# EAGLE design DACV5 (EAGLE 6.1)
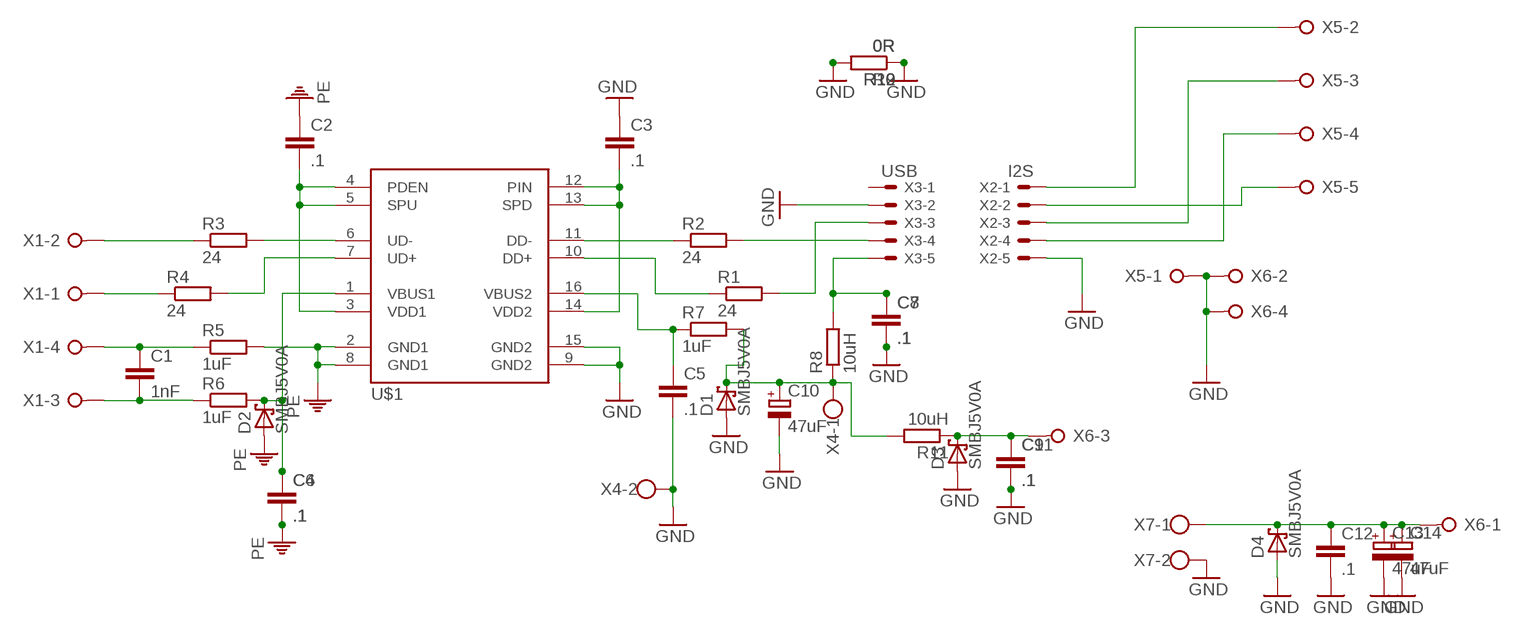
[diagram p0: schematic, sheet 1]

## Parts
C1  1nF  C-EUC1210  [C1210]
C2  .1  C-EUC1210  [C1210]
C3  .1  C-EUC1210  [C1210]
C4  .1  C-EUC1210  [C1210]
C5  .1  C-EUC1210  [C1210]
C6  .1  C-EUC1210  [C1210]
C7  .1  C-EUC1210  [C1210]
C8  .1  C-EUC1210  [C1210]
C9  .1  C-EUC1210  [C1210]
C10  47uF  CPOL-EUE5-13  [E5-13]
C11  .1  C-EUC1210  [C1210]
C12  .1  C-EUC1210  [C1210]
C13  47uF  CPOL-EUE5-13  [E5-13]
C14  47uF  CPOL-EUE5-13  [E5-13]
D1  SMBJ5V0A  MBRS130LT3  [SMB]
D2  SMBJ5V0A  MBRS130LT3  [SMB]
D3  SMBJ5V0A  MBRS130LT3  [SMB]
D4  SMBJ5V0A  MBRS130LT3  [SMB]
R1  24  R-EU_R1210  [R1210]
R2  24  R-EU_R1210  [R1210]
R3  24  R-EU_R1210  [R1210]
R4  24  R-EU_R1210  [R1210]
R5  1uF  R-EU_R1210  [R1210]
R6  1uF  R-EU_R1210  [R1210]
R7  1uF  R-EU_R1210  [R1210]
R8  10uH  R-EU_0309/12  [0309/12]
R9  0R  R-EU_0309/12  [0309/12]
R10  0R  R-EU_0309/12  [0309/12]
R11  10uH  R-EU_0309/12  [0309/12]
R12  0R  R-EU_0309/12  [0309/12]
U$1  ADUM4160  [SO16W]
X1  W237-04P  [W237-4P]
X2  I2S  22-23-2051  [22-23-2051]
X3  USB  22-23-2051  [22-23-2051]
X4  W237-102  [W237-102]
X5  W237-05P  [W237-5P]
X6  W237-04P  [W237-4P]
X7  W237-102  [W237-102]

## Nets
GND: C3.1 C5.2 C7.2 C8.2 C9.2 C10.- C11.2 C12.2 C13.- C14.- D1.A D3.A D4.A R9.1 R9.2 R10.1 R10.2 R12.1 R12.2 U$1.9(GND2) U$1.15(GND2) X2.5 X3.2 X4.2 X5.1 X6.2 X6.4 X7.2
N$1: X2.1 X5.2
N$2: R1.2 X3.3
N$3: R1.1 U$1.10(DD+)
N$4: R4.1 X1.1
N$5: R3.1 X1.2
N$6: R2.1 U$1.11(DD-)
N$7: R2.2 X3.4
N$8: R3.2 U$1.6(UD-)
N$9: R4.2 U$1.7(UD+)
N$10: C1.1 R5.1 X1.4
N$11: C1.2 R6.1 X1.3
N$12: C10.+ D1.C R7.2 R8.1 R11.2 X4.1
N$13: C7.1 C8.1 R8.2 X3.5
N$14: X2.3 X5.3
N$15: X2.2 X5.5
N$16: X2.4 X5.4
N$17: C9.1 C11.1 D3.C R11.1 X6.3
N$18: C12.1 C13.+ C14.+ D4.C X6.1 X7.1
PE: C2.1 C4.2 C6.2 D2.A R5.2 U$1.2(GND1) U$1.8(GND1)
VBUS1: C4.1 C6.1 D2.C R6.2 U$1.1(VBUS1)
VBUS2: C5.1 R7.1 U$1.16(VBUS2)
VDD1: C2.2 U$1.3(VDD1) U$1.4(PDEN) U$1.5(SPU)
VDD2: C3.2 U$1.12(PIN) U$1.13(SPD) U$1.14(VDD2)
Unconnected: X3.1

## Library data of the parts
C1-C9 C11 C12 = resistor:C-EU: CAPACITOR, European symbol
C10 C13 C14 = resistor:CPOL-EU: POLARIZED CAPACITOR, European symbol
D1-D4 = diode:MBRS130LT3: Schottky Power Rectifier Source: http://www.onsemi.com/pub/Collateral/MBRS130LT3-D.PDF
R1-R12 = resistor:R-EU_: RESISTOR, European symbol
U$1 = adum4160:ADUM4160: Analog Devices ADuM4160 Low/Full Speed USB Isolator. Production-tested footprint. Created by Circuits At Home http://www.circuitsathome.com Free to use for non-commercial purposes
X1 X6 = con-wago-508:W237-04P: WAGO SREW CLAMP; OC_FARNELL: unknown; OC_NEWARK: unknown
X2 X3 = con-molex:22-23-2051: .100" (2.54mm) Center Header - 5 Pin; MF: MOLEX; MPN: 22-23-2051; OC_FARNELL: 1462952; OC_NEWARK: 38C9178
X4 X7 = con-wago-500:W237-102: WAGO SCREW CLAMP; MPN: 237-102; OC_FARNELL: unknown; OC_NEWARK: 70K9898
X5 = con-wago-508:W237-05P: WAGO SREW CLAMP; OC_FARNELL: unknown; OC_NEWARK: unknown

## Board
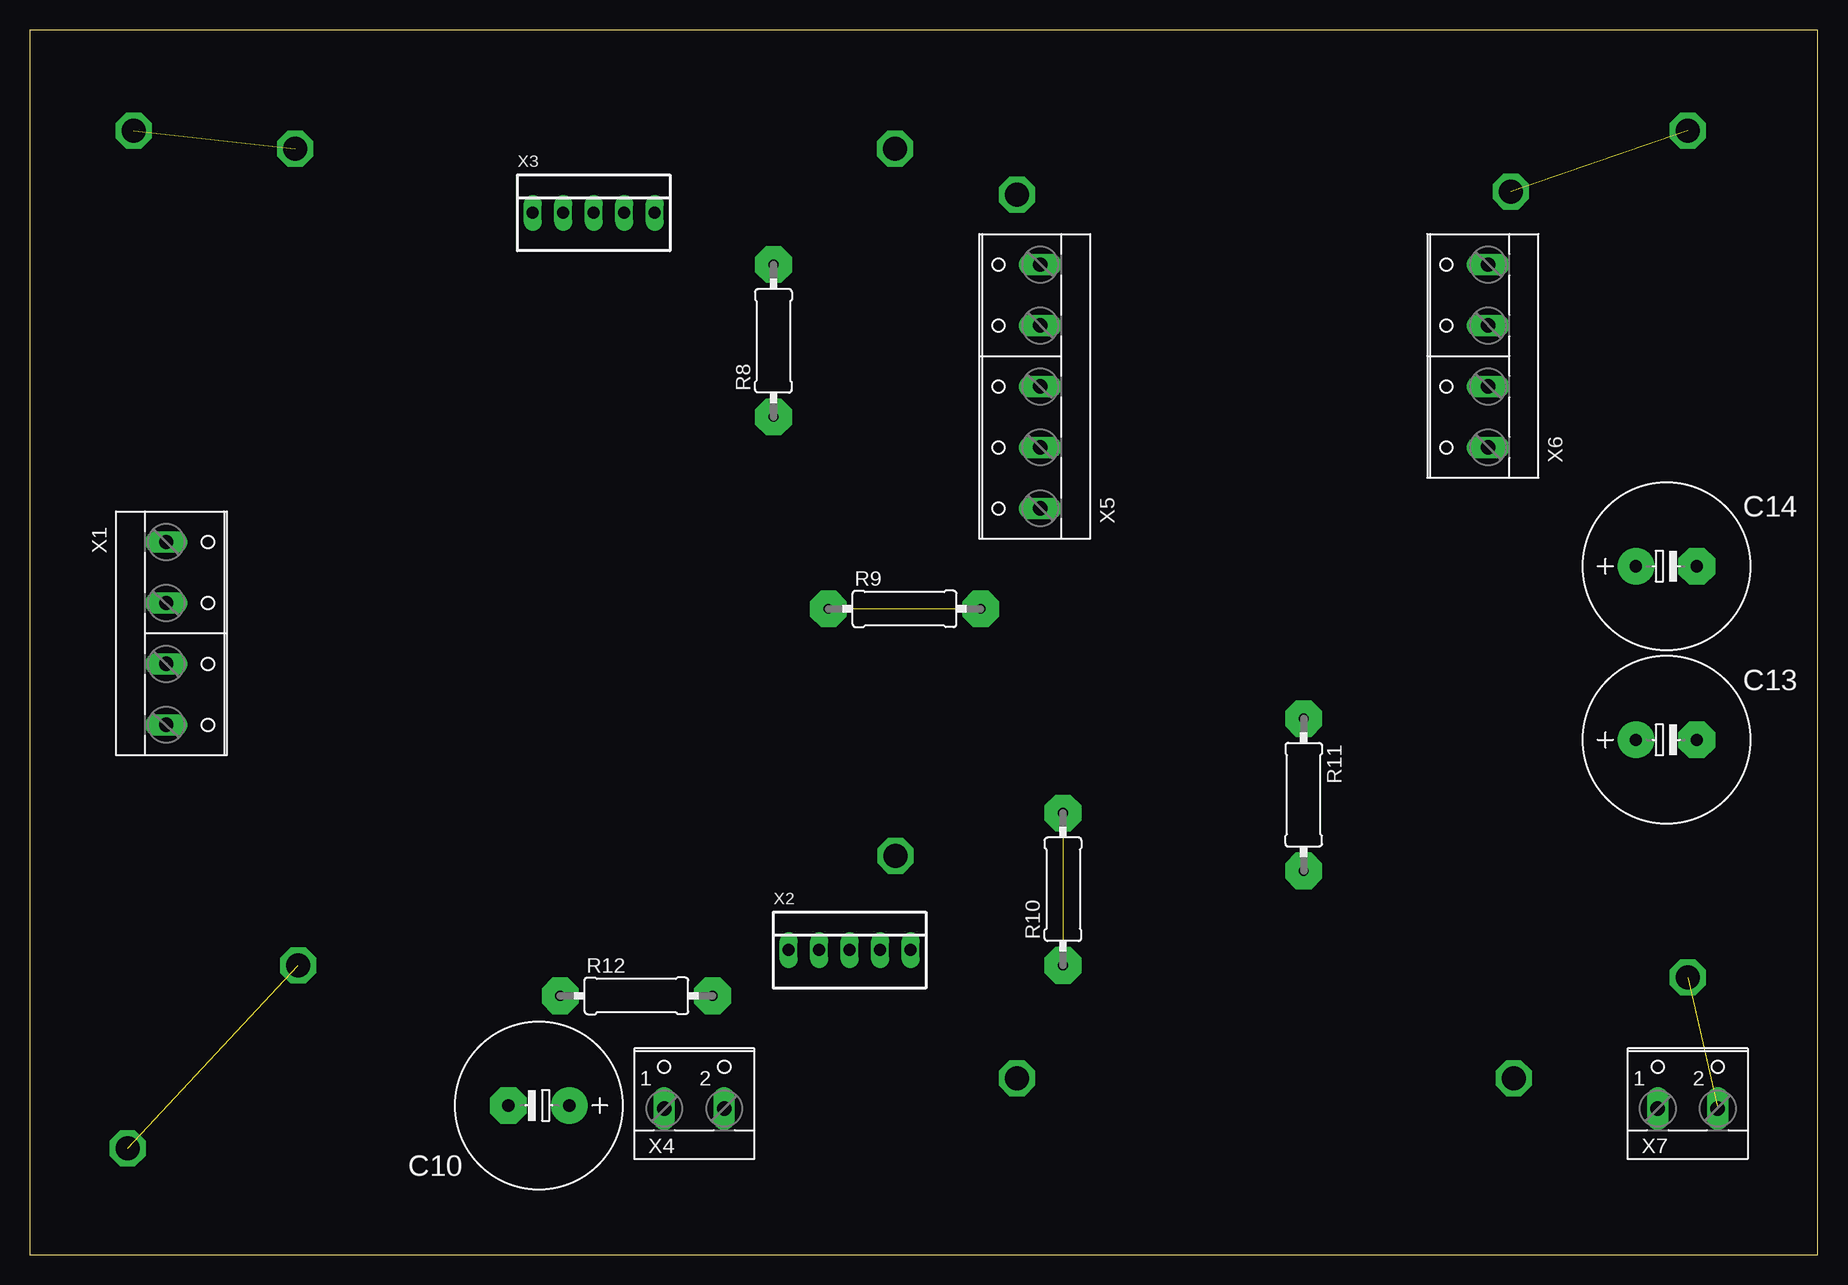
[diagram p1: board, top side]
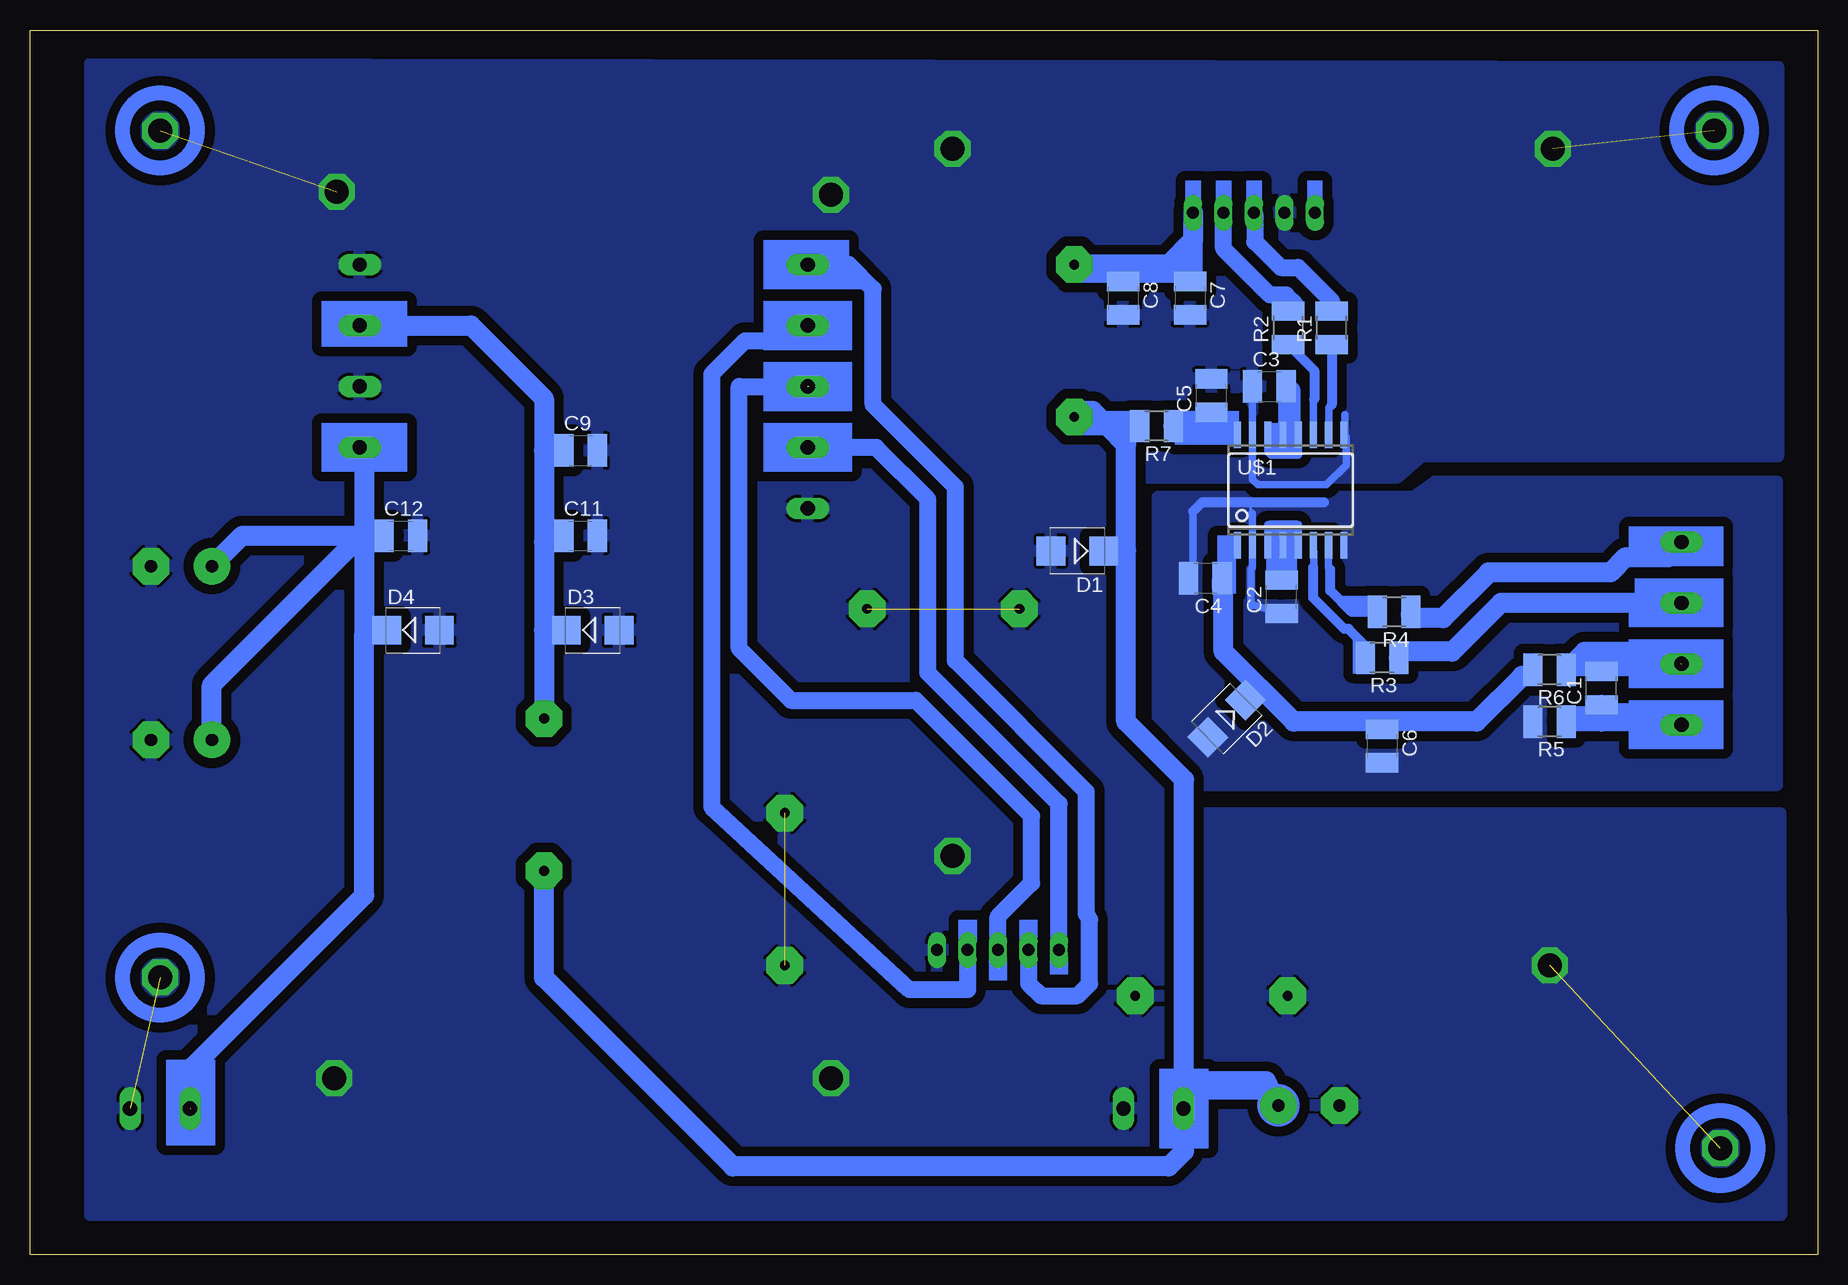
[diagram p2: board, bottom side, seen from below]

Size 149.02 x 102.09 mm. Coordinates in mm from the lower left corner, seen from the top.
Outline: 0,102.09 0,0 149.02,0 149.02,102.09 0,102.09
Copper layers (1*16): Top 0.035mm / dielectric 1.5mm / Bottom 0.035mm
Design rules: minimum track width 10mil, minimum drill 24mil, track to track 8mil, track to pad 8mil, pad to pad 8mil, via to via 8mil, smd to smd 8mil, copper to edge 40mil, drill to drill 8mil, minimum pad ring 10mil, minimum via ring 8mil, stop-mask expansion 4mil, vias tented up to drill 0mil, thermal gap 10mil

### Footprints (pad centres in the part's own frame; a part is rotated, then mirrored left to right if it is on the bottom)
C1210 = smd 1.6 x 2.7: 1 -1.4,0; 2 1.4,0
E5-13 = drill 1.016 pad 3.048: + -2.54,0 | drill 1.016 pad 3.048 octagon: - 2.54,0
SMB = smd 2.4 x 2.4: A 2.2,0; C -2.2,0
R1210 = smd 1.6 x 2.7: 1 -1.4,0; 2 1.4,0
0309/12 = drill 0.813 pad 3.048 octagon: 1 -6.35,0; 2 6.35,0
SO16W = smd 0.6 x 2.2: 1 -4.445,-4.6; 2 -3.175,-4.6; 3 -1.905,-4.6; 4 -0.635,-4.6; 5 0.635,-4.6; 6 1.905,-4.6; 7 3.175,-4.6; 8 4.445,-4.6; 9 4.445,4.6; 10 3.175,4.6; 11 1.905,4.6; 12 0.635,4.6; 13 -0.635,4.6; 14 -1.905,4.6; 15 -3.175,4.6; 16 -4.445,4.6
W237-4P = drill 1.194 long: 1 -7.62,-0.635; 2 -2.54,-0.635; 3 2.54,-0.635; 4 7.62,-0.635
22-23-2051 = drill 1 long: 1 -5.08,0; 2 -2.54,0; 3 0,0; 4 2.54,0; 5 5.08,0
W237-102 = drill 1.194 long: 1 -2.5,-1.27; 2 2.5,-1.27
W237-5P = drill 1.194 long: 1 -10.16,-0.635; 2 -5.08,-0.635; 3 0,-0.635; 4 5.08,-0.635; 5 10.16,-0.635

### Placement (x,y rotation side)
C1  18.03,47.22 90 bottom
C2  44.7,54.84 90 bottom
C3  45.72,72.37 0 bottom
C4  51.05,56.37 180 bottom
C5  50.55,71.61 90 bottom
C6  36.32,42.4 270 bottom
C7  52.32,79.74 270 bottom
C8  57.91,79.74 270 bottom
C9  103.12,67.04 0 bottom
C10  42.42,12.43 180 top
C11  103.12,59.92 0 bottom
C12  118.11,59.92 0 bottom
C13  136.4,42.91 0 top
C14  136.4,57.38 0 top
D1  61.72,58.65 180 bottom
D2  49.28,44.68 224.9 bottom
D3  102.11,52.05 0 bottom
D4  117.09,52.05 0 bottom
R1  40.51,77.26 90 bottom
R2  44.13,77.26 90 bottom
R3  36.32,49.76 180 bottom
R4  35.31,53.57 180 bottom
R5  22.35,44.43 180 bottom
R6  22.35,48.75 180 bottom
R7  55.12,69.07 180 bottom
R8  61.98,76.18 90 top
R9  72.9,53.83 0 top
R10  86.11,30.46 90 top
R11  106.17,38.33 270 top
R12  50.55,21.57 0 top
U$1  43.94,63.73 0 bottom
X1  11.99,51.78 270 top
X2  68.33,25.38 0 top
X3  46.99,86.85 0 top
X4  55.37,13.44 0 top
X5  83.57,72.37 90 top
X6  120.9,74.91 90 top
X7  138.18,13.44 0 top

### Tracks (layer width: path | path; a pad name or v marks a point on that pad's centre or on a via)
GND  (via drill 2 pad 1.68)  (6 unrouted)
  Bottom 0.61: 39.43,70.02 39.43,68.4 U$1.9 39.31,68.14 39.31,65.83 40.96,64.18 46.67,64.18 47.12,64.62 U$1.15 47.12,70.46 47.12,70.47 C3.1
  other vias: 22.1,92.18 72.11,92.18 22.35,24.11 72.14,33.25 82.27,88.37 123.44,88.63 82.27,14.71 123.67,14.71 8.64,93.71 8.13,8.87 138.18,23.09 138.18,93.71
  pour Bottom (isolate 0.813): 3.3,99.04 3.3,66.53 33.02,66.53 35.05,64.75 57.15,64.75 52.65,36.81 3.12,36.81 3.05,3.28 144.02,3.28 144.02,99.29
N$1
  Bottom 1.422: X2.1 63.25,37.57 74.17,48.49 74.17,62.97 78.49,67.29 X5.2
N$2
  Bottom 1.422: X3.3 46.93,86.78 46.93,84.44 44.77,82.28 43.31,82.28 40.51,79.48 R1.2
N$3
  Bottom 0.61: 40.51,70.85 40.77,70.59 U$1.10
  Bottom 0.813: R1.1 40.51,70.85
N$4
  Bottom 1.422: X1.1 12.61,58.15
  Bottom 1.676: R4.1 33.91,53.19 33.78,53.07 31.24,53.07 27.43,56.88 17.27,56.88 16,58.15 12.61,58.15 12.45,58.15
N$5
  Bottom 1.676: X1.2 11.37,54.34 26.42,54.34 30.48,50.27 34.54,50.27 34.54,50.14 R3.1
N$6
  Bottom 0.61: 41.97,71.29 42.04,71.23 U$1.11
  Bottom 0.813: R2.1 41.97,73.7 41.97,71.29
N$7
  Bottom 1.422: R2.2 43.56,79.23 44.32,79.99 45.66,79.99 49.53,83.86 X3.4
N$8
  Bottom 0.61: 42.06,57.28 42.01,57.33 42.01,58.55 42.04,58.58 U$1.6
  Bottom 0.813: R3.2 37.64,49.84 37.64,49.97 37.69,50.02 37.69,50.73 39.12,52.15 39.47,52.15 42.06,54.74 42.06,57.28
N$9
  Bottom 0.61: 40.64,57.13 40.79,57.28 40.79,59.16 | 40.79,59.21 40.79,59.16 | U$1.7 40.79,59.16
  Bottom 0.813: R4.2 38.86,53.57 40.64,55.35 40.64,57.13
N$10
  Bottom 1.676: X1.4 11.62,44.43 18.03,44.43 | 18.03,44.43 R5.1 | C1.1 18.03,44.43
N$11  (1 unrouted)
  Bottom 1.676: R6.1 19.43,50.27 18.03,50.27 | 18.03,50.27 12.95,50.27 11.94,49.26 11.43,49.26 | C1.2 18.03,50.27
N$12
  Bottom 1.422: D1.C 57.66,58.65 | 52.83,14.46 52.83,11.41
  Bottom 1.676: X4.1 52.83,12.21 | 52.83,14.46 52.83,39.6 57.66,44.43 57.66,58.65 57.66,67.54 59.05,68.94 | 59.05,68.94 60.45,70.34 62.23,70.34 61.98,70.08 R8.1 | R7.2 56.64,68.94 59.05,68.94 | 52.83,12.21 52.58,12.47 52.58,12.68 | C10.+ 45.97,14.46 52.83,14.46 | 52.83,14.46 52.83,12.21 | 52.83,11.41 52.83,8.62 54.1,7.35 90.42,7.35 106.17,23.09 R11.2
N$13
  Bottom 1.676: X3.5 52.07,84.56 54.1,82.53 54.23,82.53 | 54.23,82.53 57.91,82.53 | 57.91,82.53 R8.2 | C7.1 54.23,82.53 | C8.1 57.91,82.53
N$14  (1 unrouted)
  Bottom 1.422: X2.3 68.33,28.17 65.53,30.97 65.53,36.56 75.18,46.21 85.6,46.21 89.92,50.53 89.92,72.37 84.07,72.37
N$15
  Bottom 1.422: X2.2 65.79,22.59 64.77,21.57 61.72,21.57 60.71,22.59 60.71,27.92 60.96,28.43 60.96,38.59 71.88,49.51 71.88,63.99 78.74,70.85 78.74,80.5 80.77,82.53 84.07,82.53 84.33,82.78 84.33,82.53 X5.5
N$16
  Bottom 1.422: X2.4 70.87,22.08 75.69,22.08 92.2,37.32 92.2,73.39 89.41,76.18 84.84,76.18 84.84,76.94 84.58,77.2 84.58,77.07 84.96,76.69
  Bottom 1.676: X5.4 84.96,76.69
N$17
  Bottom 1.676: X6.3 112.27,77.45 106.17,71.35 106.17,67.04 | 106.17,67.04 106.17,59.42 | 106.17,52.05 R11.1 | C11.1 105.41,59.92 105.41,59.67 105.92,59.67 106.17,59.42 | 106.17,59.42 106.17,52.05 | 106.17,52.05 D3.C | C9.1 106.17,67.04
N$18  (1 unrouted)
  Bottom 1.676: X6.1 121.16,66.91 | 121.16,66.91 121.16,60.18 | 121.16,60.18 121.16,59.92 | 121.16,59.92 121.16,51.8 | D4.C 119.55,51.8 121.16,51.8 | C12.1 119.76,60.18 121.16,60.18 | 121.16,67.04 121.16,66.91 | 135.64,12.17 135.38,12.17 | X7.1 135.38,12.47 135.38,15.73 121.16,29.95 121.16,51.8 | C14.+ 131.32,59.92 121.41,59.92 | C13.+ 133.86,47.48 121.41,59.92 | 121.41,59.92 121.16,59.92
PE
  Bottom 0.254: 47.12,61.77 47.24,61.89 47.24,62.72
  Bottom 0.61: 47.18,61.83 47.12,61.77 U$1.2 47.12,57.26 47.24,57.13 47.24,54.08 47.12,54.21 C2.1 | C4.2 52.07,56.5 52.07,61.96
  Bottom 0.813: 52.07,61.96 51.31,62.72 47.24,62.72 41.15,62.72
  pour Bottom (isolate 0.813, no thermals): 3.3,64.5 32,64.5 33.78,63.23 55.12,63.23 55.12,44.94 55.09,39.07 3.3,39.07
VBUS1
  Bottom 0.254: C6.1 36.32,44.43
  Bottom 0.406: D2.C 46.74,46.24 46.74,46.72 46.74,47.22 46.74,47.48 49.53,50.27
  Bottom 0.61: U$1.1 49.28,58.25 49.28,56.37 C4.1
  Bottom 1.676: R6.2 24.26,48.24 24.64,48.24 28.45,44.43 36.32,44.43 43.69,44.43 49.53,50.27 49.53,55.35 49.65,55.48 C4.1
VBUS2
  Bottom 0.61: U$1.16 49.38,69.32 50.8,69.32 | C5.1 50.55,69.07 50.8,69.32 | 50.8,69.32 53.09,69.32
  Bottom 1.676: R7.1 53.09,69.45 53.09,69.32
VDD1
  Bottom 0.61: 44.58,60.88 43.31,60.88 U$1.5 44.17,59.13 44.45,59.42 | 44.58,60.88 45.85,60.88 U$1.3 45.85,59.04 | U$1.4 44.58,60.88
  Bottom 1.676: C2.2 44.45,57.26 44.45,59.42
VDD2
  Bottom 0.61: U$1.12 43.31,66.66 44.58,66.66 | 44.58,66.66 45.59,66.66 45.85,66.91 U$1.14 | U$1.13 44.58,66.66
  Bottom 0.813: U$1.13 44.55,68.31 43.94,68.31
  Bottom 1.676: C3.2 43.94,71.99 43.94,68.31
(copper drawn outside any net)
  shapes: Bottom area x77, Bottom circle x5